# Altium schematic sheet PWMDriver.SchDoc
size A; DocumentNumber: 12; SheetNumber: 12
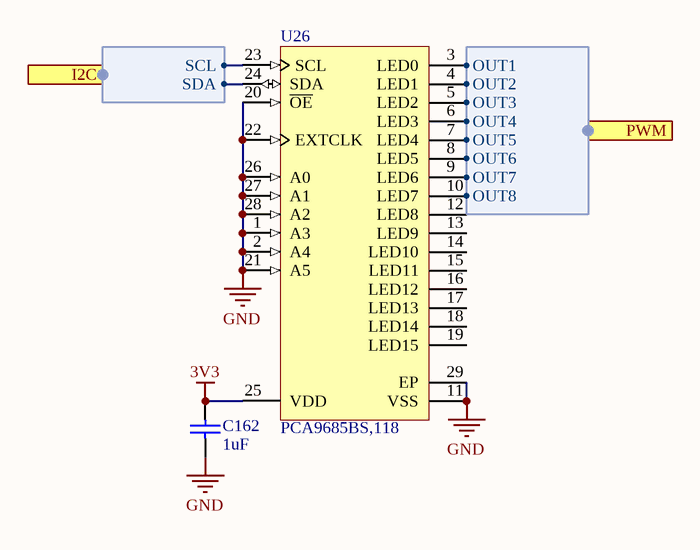
[diagram p0: PWMDriver.SchDoc]

## Parts
C162  value 1uF  [C0402[1005X55]]  (hidden comment: 1uF 6.3V 0402)
U26  PCA9685BS,118  [VQFN-28]

## Ports
I2C (harness I2C), PWM (harness PWM)

## Harnesses
I2C: SCL, SDA
PWM: OUT8, OUT7, OUT1, OUT3, OUT2, OUT4, OUT6, OUT5

## Nets
3V3: C162.2 U26.25(VDD)
GND: C162.1 U26.1(A3) U26.2(A4) U26.11(VSS) U26.20(~{OE}) U26.21(A5) U26.22(EXTCLK) U26.26(A0) U26.27(A1) U26.28(A2) U26.29(EP)
NetU26_3: U26.3(LED0) ; port PWM.OUT1
NetU26_4: U26.4(LED1) ; port PWM.OUT2
NetU26_5: U26.5(LED2) ; port PWM.OUT3
NetU26_6: U26.6(LED3) ; port PWM.OUT4
NetU26_7: U26.7(LED4) ; port PWM.OUT5
NetU26_8: U26.8(LED5) ; port PWM.OUT6
NetU26_9: U26.9(LED6) ; port PWM.OUT7
NetU26_10: U26.10(LED7) ; port PWM.OUT8
NetU26_23: U26.23(SCL) ; port I2C.SCL
NetU26_24: U26.24(SDA) ; port I2C.SDA

Not connected (* = marked no-connect by the designer): U26 12(LED8) 13(LED9) 14(LED10) 15(LED11) 16(LED12) 17(LED13) 18(LED14) 19(LED15)

## Library data of the parts
C162 = CAP_1uF_6.3V_0402_10%: 1uF 6.3V 10% 0402 (1005 Metric); PartNumber: GRM155R70J105KA12D; Manufacturer: Murata; Mounting Technology: Surface Mount; PackageReference: 0402; PackageDescription: 0402 (1005 Metric); Voltage: 6.3V; Tolerance: 10%
U26 = PCA9685BS,118: IC LED DRVR LIN DIM 25MA 28HVQFN; Manufacturer: NXP; PartNumber: PCA9685BS,118; PackageReference: QFN-28; Mounting Technology: Surface Mount